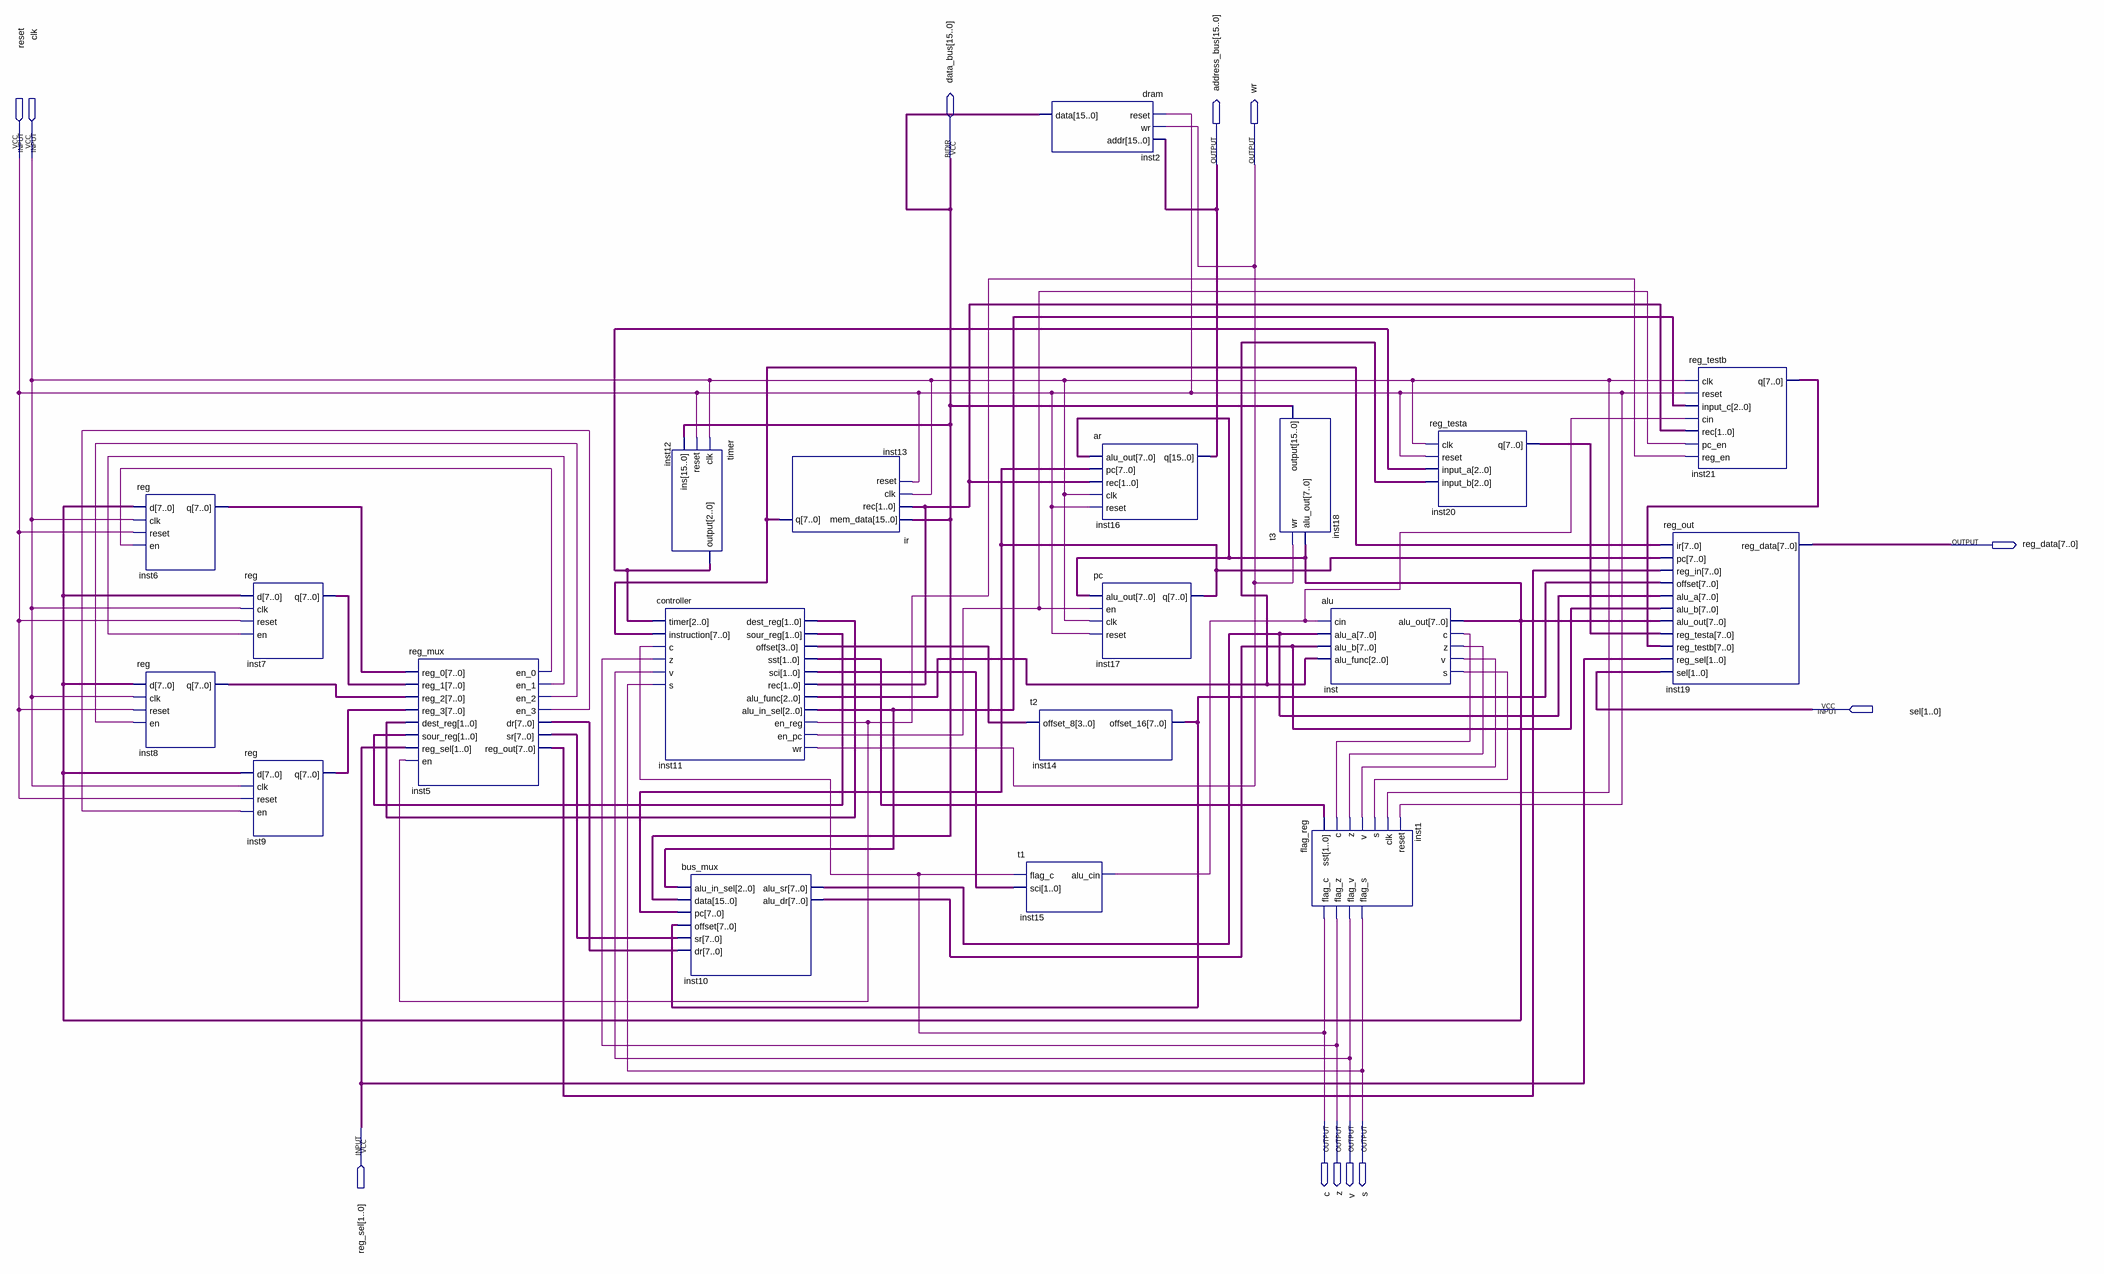
[diagram p0: schematic sheet]
// Quartus schematic 8bitCPU.bdf as structural Verilog: 20 symbols, 12 pins
module \8bitCPU  (
  input  reset,
  input  clk,
  input  [1:0] sel,
  input  [1:0] reg_sel,
  inout  [15:0] data_bus,
  output [15:0] address_bus,
  output wr,
  output [7:0] reg_data,
  output c,
  output z,
  output v,
  output s
);

  wire inst5_en_0, inst5_en_1, inst5_en_2, inst5_en_3, inst11_en_pc, inst11_en_reg, inst15_alu_cin, inst_c,
       inst_s, inst_v, inst_z;
  wire [1:0] inst11_dest_reg, inst11_rec, inst11_sci, inst11_sour_reg, inst11_sst;
  wire [2:0] inst11_alu_func, inst11_alu_in_sel, inst12_output;
  wire [3:0] inst11_offset;
  wire [7:0] inst5_dr, inst5_reg_out, inst5_sr, inst6_q, inst7_q, inst8_q, inst9_q, inst10_alu_dr,
       inst10_alu_sr, inst13_q, inst14_offset_16, inst17_q, inst20_q, inst21_q, inst_alu_out;

  \reg  inst6 (.d(inst_alu_out), .clk(clk), .reset(reset), .en(inst5_en_0), .q(inst6_q));
  \reg  inst8 (.d(inst_alu_out), .clk(clk), .reset(reset), .en(inst5_en_2), .q(inst8_q));
  \reg  inst7 (.d(inst_alu_out), .clk(clk), .reset(reset), .en(inst5_en_1), .q(inst7_q));
  \reg  inst9 (.d(inst_alu_out), .clk(clk), .reset(reset), .en(inst5_en_3), .q(inst9_q));
  reg_mux inst5 (
    .reg_0(inst6_q), .reg_1(inst7_q), .reg_2(inst8_q), .reg_3(inst9_q), .dest_reg(inst11_dest_reg),
    .sour_reg(inst11_sour_reg), .reg_sel(reg_sel), .en(inst11_en_reg), .en_0(inst5_en_0), .en_1(inst5_en_1),
    .en_2(inst5_en_2), .en_3(inst5_en_3), .dr(inst5_dr), .sr(inst5_sr), .reg_out(inst5_reg_out));
  controller inst11 (
    .timer(inst12_output), .instruction(inst13_q), .c(c), .z(z), .v(v), .s(s), .dest_reg(inst11_dest_reg),
    .sour_reg(inst11_sour_reg), .offset(inst11_offset), .sst(inst11_sst), .sci(inst11_sci), .rec(inst11_rec),
    .alu_func(inst11_alu_func), .alu_in_sel(inst11_alu_in_sel), .en_reg(inst11_en_reg), .en_pc(inst11_en_pc),
    .wr(wr));
  timer inst12 (.clk(clk), .reset(reset), .ins(data_bus), .\output (inst12_output));
  bus_mux inst10 (
    .alu_in_sel(inst11_alu_in_sel), .data(data_bus), .pc(inst17_q), .offset(inst14_offset_16), .sr(inst5_sr),
    .dr(inst5_dr), .alu_sr(inst10_alu_sr), .alu_dr(inst10_alu_dr));
  ir inst13 (.mem_data(data_bus), .rec(inst11_rec), .clk(clk), .reset(reset), .q(inst13_q));
  dram inst2 (.reset(reset), .wr(wr), .addr(address_bus), .data(data_bus));
  t2 inst14 (.offset_8(inst11_offset), .offset_16(inst14_offset_16));
  t1 inst15 (.flag_c(c), .sci(inst11_sci), .alu_cin(inst15_alu_cin));
  ar inst16 (.alu_out(inst_alu_out), .pc(inst17_q), .rec(inst11_rec), .clk(clk), .reset(reset), .q(address_bus));
  pc inst17 (.alu_out(inst_alu_out), .en(inst11_en_pc), .clk(clk), .reset(reset), .q(inst17_q));
  t3 inst18 (.wr(wr), .alu_out(inst_alu_out), .\output (data_bus));
  flag_reg inst1 (
    .sst(inst11_sst), .c(inst_c), .z(inst_z), .v(inst_v), .s(inst_s), .clk(clk), .reset(reset), .flag_c(c),
    .flag_z(z), .flag_v(v), .flag_s(s));
  alu inst (
    .cin(inst15_alu_cin), .alu_a(inst10_alu_sr), .alu_b(inst10_alu_dr), .alu_func(inst11_alu_func),
    .alu_out(inst_alu_out), .c(inst_c), .z(inst_z), .v(inst_v), .s(inst_s));
  reg_testa inst20 (.clk(clk), .reset(reset), .input_a(inst12_output), .input_b(inst11_alu_func), .q(inst20_q));
  reg_out inst19 (
    .ir(inst13_q), .pc(inst17_q), .reg_in(inst5_reg_out), .offset(inst14_offset_16), .alu_a(inst10_alu_sr),
    .alu_b(inst10_alu_dr), .alu_out(inst_alu_out), .reg_testa(inst20_q), .reg_testb(inst21_q),
    .reg_sel(reg_sel), .sel(sel), .reg_data(reg_data));
  reg_testb inst21 (
    .clk(clk), .reset(reset), .input_c(inst11_alu_in_sel), .cin(inst15_alu_cin), .rec(inst11_rec),
    .pc_en(inst11_en_pc), .reg_en(inst11_en_reg), .q(inst21_q));
endmodule
